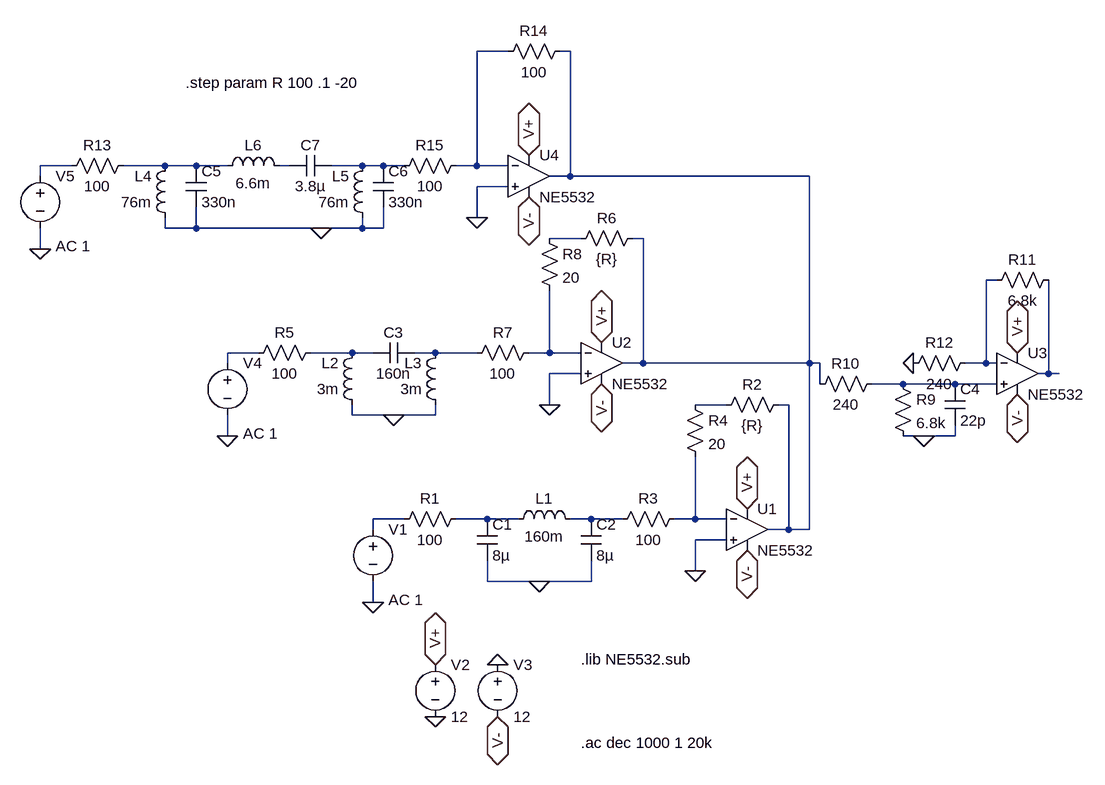
[diagram p0: schematic Tone_Control.asc]
Tone_Control.asc, the LTspice schematic file:
Version 4
SHEET 1 880 680
WIRE -176 -608 -224 -608
WIRE -80 -608 -96 -608
WIRE -848 -432 -896 -432
WIRE -704 -432 -768 -432
WIRE -656 -432 -704 -432
WIRE -608 -432 -656 -432
WIRE -512 -432 -528 -432
WIRE -400 -432 -448 -432
WIRE -368 -432 -400 -432
WIRE -336 -432 -368 -432
WIRE -224 -432 -224 -608
WIRE -224 -432 -256 -432
WIRE -176 -432 -224 -432
WIRE -896 -416 -896 -432
WIRE -80 -416 -80 -608
WIRE -80 -416 -112 -416
WIRE 288 -416 -80 -416
WIRE -176 -400 -224 -400
WIRE -224 -352 -224 -400
WIRE -704 -336 -704 -352
WIRE -656 -336 -656 -368
WIRE -656 -336 -704 -336
WIRE -464 -336 -656 -336
WIRE -400 -336 -400 -352
WIRE -400 -336 -464 -336
WIRE -368 -336 -368 -368
WIRE -368 -336 -400 -336
WIRE -64 -320 -112 -320
WIRE 32 -320 16 -320
WIRE -896 -304 -896 -336
WIRE 576 -256 560 -256
WIRE -560 -144 -608 -144
WIRE -416 -144 -480 -144
WIRE -384 -144 -416 -144
WIRE -288 -144 -320 -144
WIRE -224 -144 -288 -144
WIRE -112 -144 -112 -240
WIRE -112 -144 -144 -144
WIRE -64 -144 -112 -144
WIRE -608 -128 -608 -144
WIRE 32 -128 32 -320
WIRE 32 -128 0 -128
WIRE 288 -128 288 -416
WIRE 288 -128 32 -128
WIRE 304 -128 288 -128
WIRE 560 -128 560 -256
WIRE 560 -128 528 -128
WIRE 576 -128 560 -128
WIRE -64 -112 -112 -112
WIRE 656 -112 656 -256
WIRE 656 -112 640 -112
WIRE 672 -112 656 -112
WIRE 304 -96 304 -128
WIRE 432 -96 384 -96
WIRE 512 -96 432 -96
WIRE 576 -96 512 -96
WIRE -112 -64 -112 -112
WIRE 160 -64 112 -64
WIRE 256 -64 240 -64
WIRE -416 -48 -416 -64
WIRE -352 -48 -416 -48
WIRE -288 -48 -288 -64
WIRE -288 -48 -352 -48
WIRE -608 -16 -608 -48
WIRE 464 -16 432 -16
WIRE 512 -16 512 -32
WIRE 512 -16 464 -16
WIRE -336 112 -384 112
WIRE -208 112 -256 112
WIRE -160 112 -208 112
WIRE -48 112 -80 112
WIRE 0 112 -48 112
WIRE 112 112 112 16
WIRE 112 112 80 112
WIRE 160 112 112 112
WIRE -384 128 -384 112
WIRE 256 128 256 -64
WIRE 256 128 224 128
WIRE 288 128 288 -128
WIRE 288 128 256 128
WIRE 160 144 112 144
WIRE 112 192 112 144
WIRE -208 208 -208 176
WIRE -128 208 -208 208
WIRE -48 208 -48 176
WIRE -48 208 -128 208
WIRE -384 240 -384 208
FLAG 112 192 0
FLAG -384 240 0
FLAG -288 336 V+
IOPIN -288 336 BiDir
FLAG 192 96 V+
IOPIN 192 96 BiDir
FLAG -192 416 V-
IOPIN -192 416 BiDir
FLAG 192 160 V-
IOPIN 192 160 BiDir
FLAG -192 336 0
FLAG -288 416 0
FLAG -128 208 0
FLAG -112 -64 0
FLAG -608 -16 0
FLAG -32 -160 V+
IOPIN -32 -160 BiDir
FLAG -32 -96 V-
IOPIN -32 -96 BiDir
FLAG -352 -48 0
FLAG 608 -144 V+
IOPIN 608 -144 BiDir
FLAG 608 -80 V-
IOPIN 608 -80 BiDir
FLAG 464 -16 0
FLAG 448 -128 0
FLAG -224 -352 0
FLAG -896 -304 0
FLAG -144 -448 V+
IOPIN -144 -448 BiDir
FLAG -144 -384 V-
IOPIN -144 -384 BiDir
FLAG -464 -336 0
SYMBOL Opamps\\opamp2 192 64 R0
SYMATTR InstName U1
SYMATTR Value NE5532
SYMBOL voltage -384 112 R0
WINDOW 123 24 124 Left 2
WINDOW 39 0 0 Left 2
SYMATTR Value2 AC 1
SYMATTR InstName V1
SYMATTR Value ""
SYMBOL voltage -288 320 R0
WINDOW 123 0 0 Left 2
WINDOW 39 0 0 Left 2
SYMATTR InstName V2
SYMATTR Value 12
SYMBOL voltage -192 320 R0
WINDOW 123 0 0 Left 2
WINDOW 39 0 0 Left 2
SYMATTR InstName V3
SYMATTR Value 12
SYMBOL res -240 96 R90
WINDOW 0 0 56 VBottom 2
WINDOW 3 32 56 VTop 2
SYMATTR InstName R1
SYMATTR Value 100
SYMBOL res 256 -80 R90
WINDOW 0 0 56 VBottom 2
WINDOW 3 32 56 VTop 2
SYMATTR InstName R2
SYMATTR Value {R}
SYMBOL cap -224 112 R0
SYMATTR InstName C1
SYMATTR Value 8µ
SYMBOL ind -176 128 R270
WINDOW 0 32 56 VTop 2
WINDOW 3 5 56 VBottom 2
SYMATTR InstName L1
SYMATTR Value 160m
SYMBOL cap -64 112 R0
SYMATTR InstName C2
SYMATTR Value 8µ
SYMBOL res -16 128 R270
WINDOW 0 32 56 VTop 2
WINDOW 3 0 56 VBottom 2
SYMATTR InstName R3
SYMATTR Value 100
SYMBOL res 96 -80 R0
SYMATTR InstName R4
SYMATTR Value 20
SYMBOL Opamps\\opamp2 -32 -192 R0
SYMATTR InstName U2
SYMATTR Value NE5532
SYMBOL voltage -608 -144 R0
WINDOW 123 24 124 Left 2
WINDOW 39 0 0 Left 2
SYMATTR Value2 AC 1
SYMATTR InstName V4
SYMATTR Value ""
SYMBOL res -464 -160 R90
WINDOW 0 0 56 VBottom 2
WINDOW 3 32 56 VTop 2
SYMATTR InstName R5
SYMATTR Value 100
SYMBOL res 32 -336 R90
WINDOW 0 0 56 VBottom 2
WINDOW 3 32 56 VTop 2
SYMATTR InstName R6
SYMATTR Value {R}
SYMBOL res -240 -128 R270
WINDOW 0 32 56 VTop 2
WINDOW 3 0 56 VBottom 2
SYMATTR InstName R7
SYMATTR Value 100
SYMBOL res -128 -336 R0
SYMATTR InstName R8
SYMATTR Value 20
SYMBOL cap -384 -128 R270
WINDOW 0 32 32 VTop 2
WINDOW 3 0 32 VBottom 2
SYMATTR InstName C3
SYMATTR Value 160n
SYMBOL ind -400 -48 R180
WINDOW 0 36 80 Left 2
WINDOW 3 36 40 Left 2
SYMATTR InstName L2
SYMATTR Value 3m
SYMBOL ind -272 -48 R180
WINDOW 0 36 80 Left 2
WINDOW 3 36 40 Left 2
SYMATTR InstName L3
SYMATTR Value 3m
SYMBOL Opamps\\opamp2 608 -176 R0
SYMATTR InstName U3
SYMATTR Value NE5532
SYMBOL cap 496 -96 R0
SYMATTR InstName C4
SYMATTR Value 22p
SYMBOL res 416 -112 R0
SYMATTR InstName R9
SYMATTR Value 6.8k
SYMBOL res 288 -80 R270
WINDOW 0 32 56 VTop 2
WINDOW 3 0 56 VBottom 2
SYMATTR InstName R10
SYMATTR Value 240
SYMBOL res 560 -240 R270
WINDOW 0 32 56 VTop 2
WINDOW 3 0 56 VBottom 2
SYMATTR InstName R11
SYMATTR Value 6.8k
SYMBOL res 432 -112 R270
WINDOW 0 32 56 VTop 2
WINDOW 3 0 56 VBottom 2
SYMATTR InstName R12
SYMATTR Value 240
SYMBOL Opamps\\opamp2 -144 -480 R0
SYMATTR InstName U4
SYMATTR Value NE5532
SYMBOL voltage -896 -432 R0
WINDOW 123 24 124 Left 2
WINDOW 39 0 0 Left 2
SYMATTR Value2 AC 1
SYMATTR InstName V5
SYMATTR Value ""
SYMBOL res -752 -448 R90
WINDOW 0 0 56 VBottom 2
WINDOW 3 32 56 VTop 2
SYMATTR InstName R13
SYMATTR Value 100
SYMBOL res -80 -624 R90
WINDOW 0 0 56 VBottom 2
WINDOW 3 32 56 VTop 2
SYMATTR InstName R14
SYMATTR Value 100
SYMBOL res -352 -416 R270
WINDOW 0 32 56 VTop 2
WINDOW 3 0 56 VBottom 2
SYMATTR InstName R15
SYMATTR Value 100
SYMBOL ind -688 -336 R180
WINDOW 0 36 80 Left 2
WINDOW 3 36 40 Left 2
SYMATTR InstName L4
SYMATTR Value 76m
SYMBOL ind -384 -336 R180
WINDOW 0 36 80 Left 2
WINDOW 3 36 40 Left 2
SYMATTR InstName L5
SYMATTR Value 76m
SYMBOL cap -672 -432 R0
SYMATTR InstName C5
SYMATTR Value 330n
SYMBOL cap -384 -432 R0
SYMATTR InstName C6
SYMATTR Value 330n
SYMBOL ind -624 -416 R270
WINDOW 0 32 56 VTop 2
WINDOW 3 5 56 VBottom 2
SYMATTR InstName L6
SYMATTR Value 6.6m
SYMBOL cap -512 -416 R270
WINDOW 0 32 32 VTop 2
WINDOW 3 0 32 VBottom 2
SYMATTR InstName C7
SYMATTR Value 3.8µ
TEXT -64 328 Left 2 !.lib NE5532.sub
TEXT -64 456 Left 2 !.ac dec 1000 1 20k
TEXT -672 -560 Left 2 !.step param R 100 .1 -20

The netlist it stands for:
* Tone_Control.asc
XU1 0 N019 V+ V- N002 NE5532  ; pins In+ In- V+ V- OUT
V1 N016 0 AC 1
V2 V+ 0 12
V3 0 V- 12
R1 N017 N016 100
R2 N002 N015 {R}
C1 N017 0 8µ
L1 N017 N018 160m
C2 N018 0 8µ
R3 N018 N019 100
R4 N015 N019 20
XU2 0 N012 V+ V- N002 NE5532  ; pins In+ In- V+ V- OUT
V4 N009 0 AC 1
R5 N010 N009 100
R6 N002 N007 {R}
R7 N011 N012 100
R8 N007 N012 20
C3 N010 N011 160n
L2 0 N010 3m
L3 0 N011 3m
XU3 N014 N008 V+ V- N013 NE5532  ; pins In+ In- V+ V- OUT
C4 N014 0 22p
R9 N014 0 6.8k
R10 N002 N014 240
R11 N008 N013 6.8k
R12 0 N008 240
XU4 0 N001 V+ V- N002 NE5532  ; pins In+ In- V+ V- OUT
V5 N003 0 AC 1
R13 N004 N003 100
R14 N002 N001 100
R15 N006 N001 100
L4 0 N004 76m
L5 0 N006 76m
C5 N004 0 330n
C6 N006 0 330n
L6 N004 N005 6.6m
C7 N005 N006 3.8µ
.lib NE5532.sub
.ac dec 1000 1 20k
.step param R 100 .1 -20
.backanno
.end